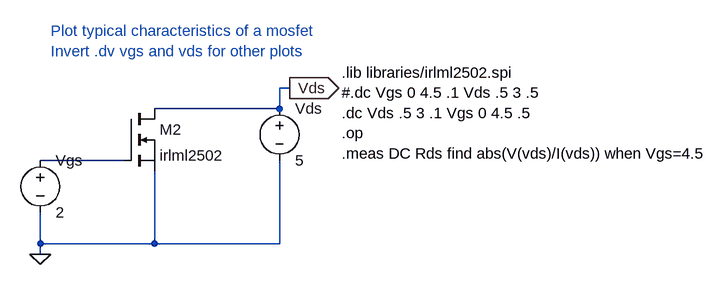
[diagram p0: schematic mosfet_characteristic.asc]
mosfet_characteristic.asc, the LTspice schematic file:
Version 4
SHEET 1 1224 680
WIRE 576 272 560 272
WIRE 560 304 560 272
WIRE 560 304 368 304
WIRE 320 384 192 384
WIRE 192 512 192 464
WIRE 368 512 368 400
WIRE 368 512 192 512
WIRE 560 512 560 384
WIRE 560 512 368 512
WIRE 192 528 192 512
FLAG 192 528 0
FLAG 576 272 Vds
IOPIN 576 272 Out
SYMBOL Voltage 192 368 R0
SYMATTR InstName Vgs
SYMATTR Value 2
SYMBOL Voltage 560 288 R0
SYMATTR InstName Vds
SYMATTR Value 5
SYMBOL nmos 320 304 R0
SYMATTR InstName M2
SYMATTR Value irlml2502
SYMATTR Prefix X
TEXT 656 248 Left 2 !.lib libraries/irlml2502.spi\n#.dc Vgs 0 4.5 .1 Vds .5 3 .5\n.dc Vds .5 3 .1 Vgs 0 4.5 .5\n.op\n.meas DC Rds find abs(V(vds)/I(vds)) when Vgs=4.5
TEXT 208 184 Left 2 ;Plot typical characteristics of a mosfet\nInvert .dv vgs and vds for other plots

The netlist it stands for:
* mosfet_characteristic.asc
Vgs N001 0 2
Vds Vds 0 5
XM2 Vds N001 0 irlml2502  ; pins D G S
.lib libraries/irlml2502.spi
#.dc Vgs 0 4.5 .1 Vds .5 3 .5
.dc Vds .5 3 .1 Vgs 0 4.5 .5
.op
.meas DC Rds find abs(V(vds)/I(vds)) when Vgs=4.5
* Plot typical characteristics of a mosfet
* Invert .dv vgs and vds for other plots
.backanno
.end